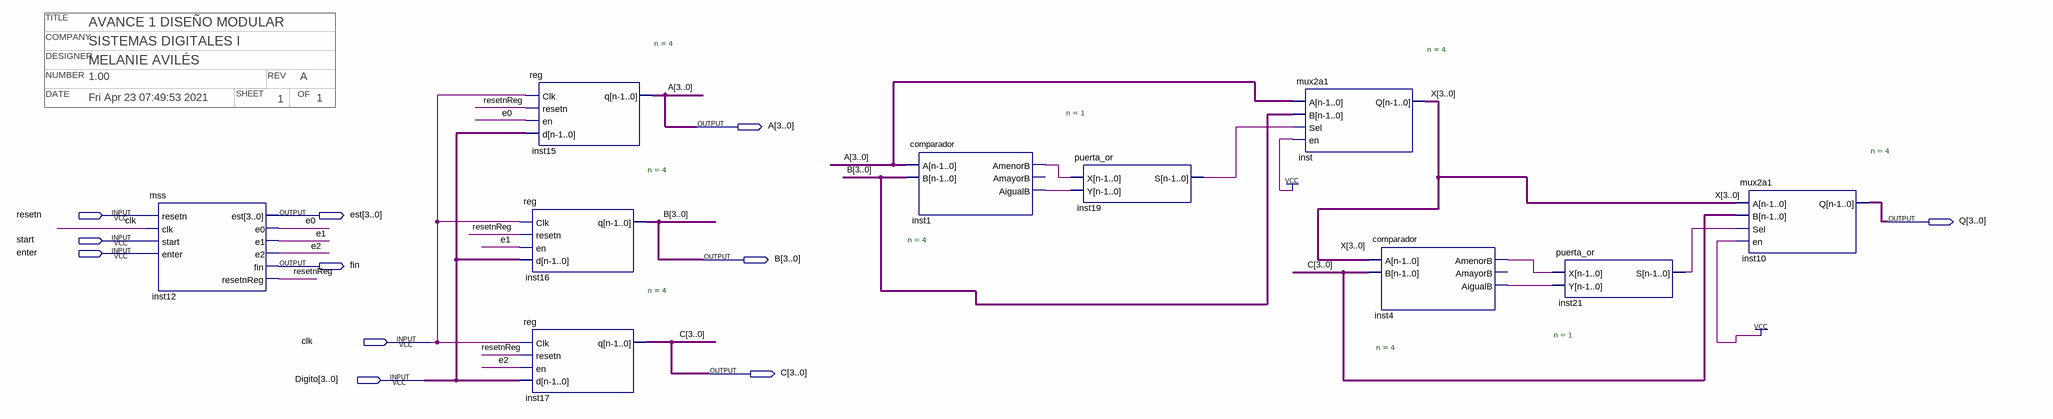
[diagram p0: schematic sheet]
// Quartus schematic AVANCE1.bdf as structural Verilog: 10 symbols, 11 pins
// Title block: COMPANY: SISTEMAS DIGITALES I; DATE: Fri Apr 23 07:49:53 2021; DESIGNER: MELANIE AVILÉS; NUMBER: 1.00; OF: 1; REV: A; SHEET: 1; TITLE: AVANCE 1 DISEÑO MODULAR
module AVANCE1 (
  input  resetn,
  input  start,
  input  enter,
  input  clk,
  input  [3:0] Digito,
  output [3:0] A,
  output [3:0] est,
  output [3:0] Q,
  output [3:0] B,
  output fin,
  output [3:0] C
);

  wire e0, e1, e2, inst1_aigualb, inst1_amenorb, inst4_aigualb, inst4_amenorb, inst19_s, inst21_s, resetnReg;
  wire [3:0] X;

  mss inst12 (
    .resetn(resetn), .clk(clk), .start(start), .enter(enter), .est(est), .e0(e0), .e1(e1), .e2(e2),
    .fin(fin), .resetnReg(resetnReg));
  \reg  #(.n(4)) inst15 (.Clk(clk), .resetn(resetnReg), .en(e0), .d(Digito), .q(A));
  \reg  #(.n(4)) inst16 (.Clk(clk), .resetn(resetnReg), .en(e1), .d(Digito), .q(B));
  \reg  #(.n(4)) inst17 (.Clk(clk), .resetn(resetnReg), .en(e2), .d(Digito), .q(C));
  comparador #(.n(4)) inst1 (.A(A), .B(B), .AmenorB(inst1_amenorb), .AigualB(inst1_aigualb));  // open: AmayorB
  puerta_or #(.n(1)) inst19 (.X(inst1_amenorb), .Y(inst1_aigualb), .S(inst19_s));
  mux2a1 #(.n(4)) inst (.A(A), .B(B), .Sel(inst19_s), .en(1'b1), .Q(X));
  comparador #(.n(4)) inst4 (.A(X), .B(C), .AmenorB(inst4_amenorb), .AigualB(inst4_aigualb));  // open: AmayorB
  puerta_or #(.n(1)) inst21 (.X(inst4_amenorb), .Y(inst4_aigualb), .S(inst21_s));
  mux2a1 #(.n(4)) inst10 (.A(X), .B(C), .Sel(inst21_s), .en(1'b1), .Q(Q));
endmodule
